# Altium project GitRepoTest.PrjPcb
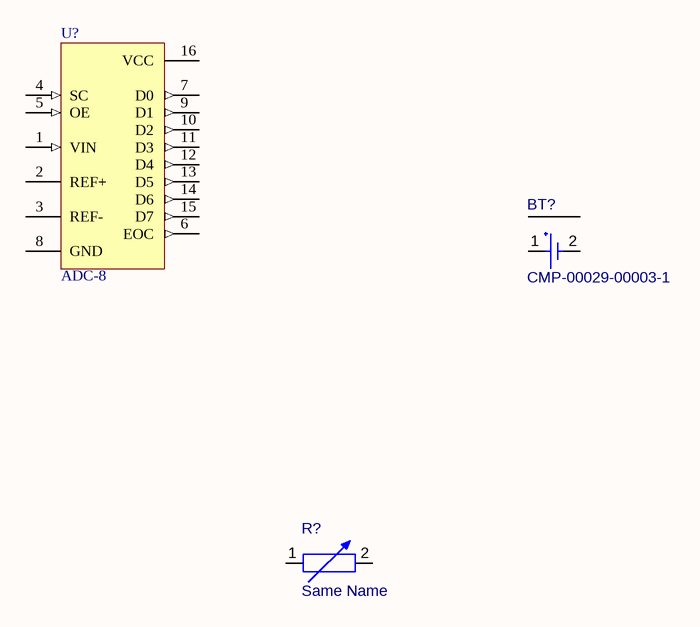
[diagram p0: Sheet3.SchDoc]
3 sheets, 5 parts. Net scope: global (net labels, ports and power ports of the same name join across sheets).
Board file: PCB3.PcbDoc
Sheets:
  Sheet3.SchDoc
  Sheet1.SchDoc
  Sheet2.SchDoc

## Sheet Sheet3.SchDoc
size A4; SheetNumber: 1; SheetTotal: 3; SPICEModelCacheRSGLDQOS: <root> / <DocumentId>RSGLDQOS</DocumentId> / <CacheFrame Number="0"> / <Model Name="adc8" Kind="MDL"> / <Text>* 8-Bit generic A/D converter / * INPUTS  VCC, GND, VIN, VRP, VRM, SC, OE; / * OUTPUTS VCC_LD, SC_LD, OE_LD, OC, D0, D1, D2, D3, D4, D5, D6, D7; / .MODEL ADC8 xsimcode(file="{MODEL_PATH}ADC8.scb" func=ADC8 {mntymx})</Text> / </Model> / </CacheFrame> / </root>

### Parts
(Parts that share a designator on the sheet are numbered #1, #2 ... from top to bottom, then left to right.)
BT?#1  CMP-00029-00003-1  [KEMT-T491-D_L]
R?#1  Same Name  [CAPC0603(1608)100_L]
U?  ADC-8  [SOT403-1_N]

### Nets

Not connected (* = marked no-connect by the designer): BT?#1 1(+) 2(-); R?#1 1 2; U? 1(VIN) 2(REF+) 3(REF-) 4(SC) 5(OE) 6(EOC) 7(D0) 8(GND) 9(D1) 10(D2) 11(D3) 12(D4) 13(D5) 14(D6) 15(D7) 16(VCC)

### Library data of the parts
BT?#1 = CMP-00027-00009-1: PDF-NAME: PDF; STEP-NAME: STEP; Min Operating Temperature: 1°C; Component Type: Standard; Design Item ID: CMP-00029-00003-1; Max Operating Temperature: 1°C; STEP-URL: C:\Users\Public\Documents; Pins: 2; PDF-URL: C:\Users\AllenNg\Desktop\Active Cases\00686628\Parameter Import; Source: Parameter Import.SchLib
R?#1 = CMP-00027-00010-2: Test 2
U? = ADC-8: Generic 8-Bit A/D Converter; Published: 8-Jun-2000; LatestRevisionDate: 29-May-2009; LatestRevisionNote: IPC-7351 Footprint Added.; PackageVersion: Mar-2002; PackageReference: SOT403-1; Publisher: Altium Limited; PackageDescription: 16-Pin Thin Small Outline Package 0.65 mm Pitch; Code_JEDEC: MO-153

## Sheet Sheet1.SchDoc
size A4; SheetNumber: 2; SheetTotal: 3
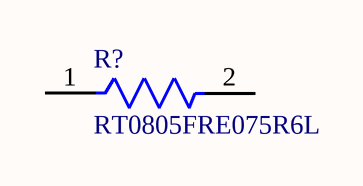
[diagram p1: Sheet1.SchDoc]

### Parts
(Parts that share a designator on the sheet are numbered #1, #2 ... from top to bottom, then left to right.)
R?#2  RT0805FRE075R6L  [FP-RT0805-MFG]

### Nets

Not connected (* = marked no-connect by the designer): R?#2 1 2

### Library data of the parts
R?#2 = CMP-00027-00017-1: Fixed Resistor, Thin Film, 0.125W, 5.6ohm, 150V, 1% +/-Tol, 50ppm/Cel, Surface Mount, 0805; RoHS Compliant: Yes; Min Operating Temperature: -55°C; Mounting Technology: Surface Mount; Max Operating Temperature: 155°C; Pins: 2; Case/Package: 0805

## Sheet Sheet2.SchDoc
size A4; SheetNumber: 3; SheetTotal: 3
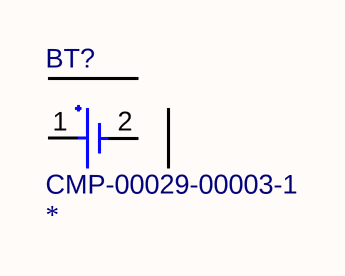
[diagram p2: Sheet2.SchDoc]

### Parts
(Parts that share a designator on the sheet are numbered #1, #2 ... from top to bottom, then left to right.)
BT?#2  CMP-00029-00003-1  [KEMT-T491-D_L]

### Nets

Not connected (* = marked no-connect by the designer): BT?#2 1(+) 2(-)

### Library data of the parts
BT?#2 = CMP-00027-00011-1: Link 1: C:\Users\AllenNg\Desktop\Active Cases\00686628\Notes.txt; Link 2: C:\Users\AllenNg\Desktop\Active Cases\00686753\Mating_910260_RevA_Altium\Mating_910260_RevA_Altium\Project Outputs for Mating_910260_RevA\BOM\BOM_910260_RevA.pdf; Parameter 1: *; ComponentLink1Description: New link; Design Item ID: CMP-00029-00003-1; ComponentLink2URL: www.altium.com/documentation/altium-designer/working-with-schematic-libraries; ComponentLink1URL: https://www.altium.com/documentation/altium-designer/working-with-schematic-libraries; Min Operating Temperature: 1°C; Source: Parameter Import.SchLib; Max Operating Temperature: 1°C; Pins: 2; ComponentLink2Description: New Link 2; Link 3: https://www.altium.com/documentation/altium-designer/working-with-schematic-libraries; Component Type: Standard; Link 4: www.altium.com/documentation/altium-designer/working-with-schematic-libraries